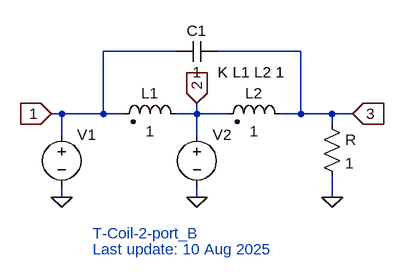
[diagram p0: schematic T-Coil-2-port_B.asc]
T-Coil-2-port_B.asc, the LTspice schematic file:
Version 4
SHEET 1 1164 680
WIRE 320 -96 208 -96
WIRE 512 -96 384 -96
WIRE 144 0 128 0
WIRE 208 0 208 -96
WIRE 208 0 144 0
WIRE 240 0 208 0
WIRE 352 0 352 -16
WIRE 352 0 320 0
WIRE 400 0 352 0
WIRE 512 0 512 -96
WIRE 512 0 480 0
WIRE 560 0 512 0
WIRE 592 0 560 0
WIRE 560 16 560 0
WIRE 144 32 144 0
WIRE 352 32 352 0
WIRE 144 128 144 112
WIRE 352 128 352 112
WIRE 560 128 560 96
FLAG 144 128 0
FLAG 560 128 0
FLAG 352 128 0
FLAG 128 0 1
IOPIN 128 0 In
FLAG 352 -16 2
IOPIN 352 -16 In
FLAG 592 0 3
IOPIN 592 0 In
SYMBOL voltage 144 16 R0
WINDOW 3 24 96 Invisible 2
WINDOW 123 0 0 Left 0
WINDOW 39 0 0 Left 0
SYMATTR Value 1
SYMATTR InstName V1
SYMBOL ind2 336 16 M270
WINDOW 0 32 56 VTop 2
WINDOW 3 5 56 VBottom 2
SYMATTR InstName L1
SYMATTR Value 1
SYMATTR Type ind
SYMBOL ind2 496 16 M270
WINDOW 0 32 56 VTop 2
WINDOW 3 5 56 VBottom 2
SYMATTR InstName L2
SYMATTR Value 1
SYMATTR Type ind
SYMBOL cap 384 -112 R90
WINDOW 0 0 32 VBottom 2
WINDOW 3 32 32 VTop 2
SYMATTR InstName C1
SYMATTR Value 1
SYMBOL voltage 352 16 R0
WINDOW 3 24 96 Invisible 2
WINDOW 123 0 0 Left 0
WINDOW 39 0 0 Left 0
SYMATTR Value 1
SYMATTR InstName V2
SYMBOL res 544 0 R0
SYMATTR InstName R
SYMATTR Value 1
TEXT 384 -64 Left 2 !K L1 L2 1
TEXT 192 184 Left 2 ;T-Coil-2-port_B
TEXT 192 208 Left 2 ;Last update: 10 Aug 2025

The netlist it stands for:
* T-Coil-2-port_B.asc
V1 1 0 1
L1 2 1 1
L2 3 2 1
C1 3 1 1
V2 2 0 1
R 3 0 1
K L1 L2 1
* T-Coil-2-port_B
* Last update: 10 Aug 2025
.backanno
.end